# Altium schematic sheet DDM_FOC_CostDown_Modify_X1.4.schdoc
size D; PageSetup: Record=PageOptions|CenterHorizontal=True|CenterVertical=True|PrintScale=0.51|XCorrection=1.00|YCorrection=1.00|PrintKind=1|BorderSize=5000000|LeftOffset=0|BottomOffset=0|Orientation=2|PaperLength=1000|PaperWidth=1000|Scale=100|PaperSource=15|PrintQuality=600|MediaType=1|DitherType=10|PrintScaleMode=1|PaperKind=A3
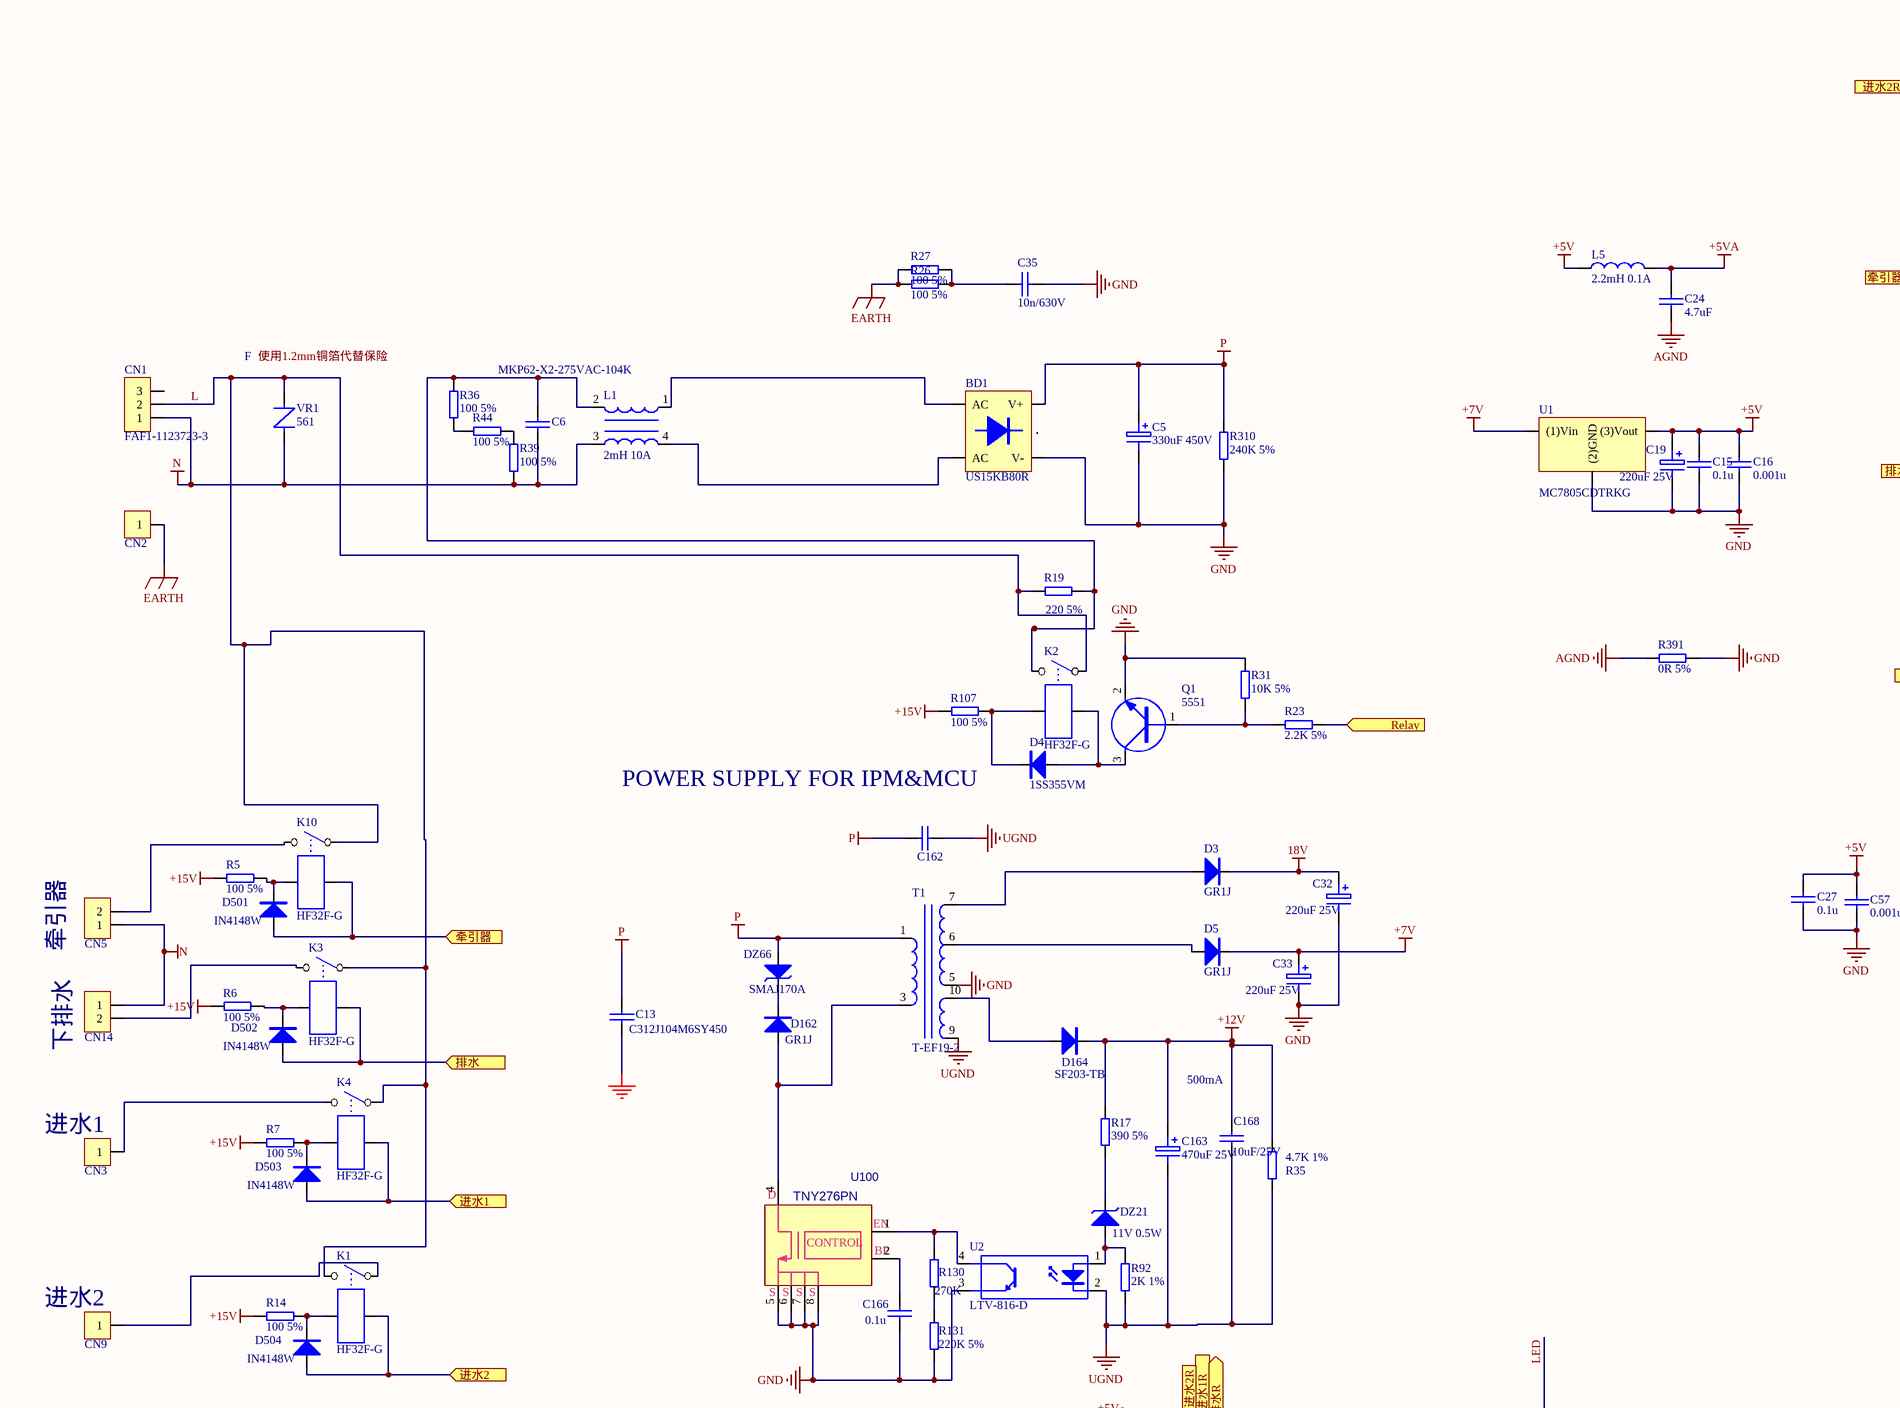
[diagram p0: DDM_FOC_CostDown_Modify_X1.4.schdoc, top left]
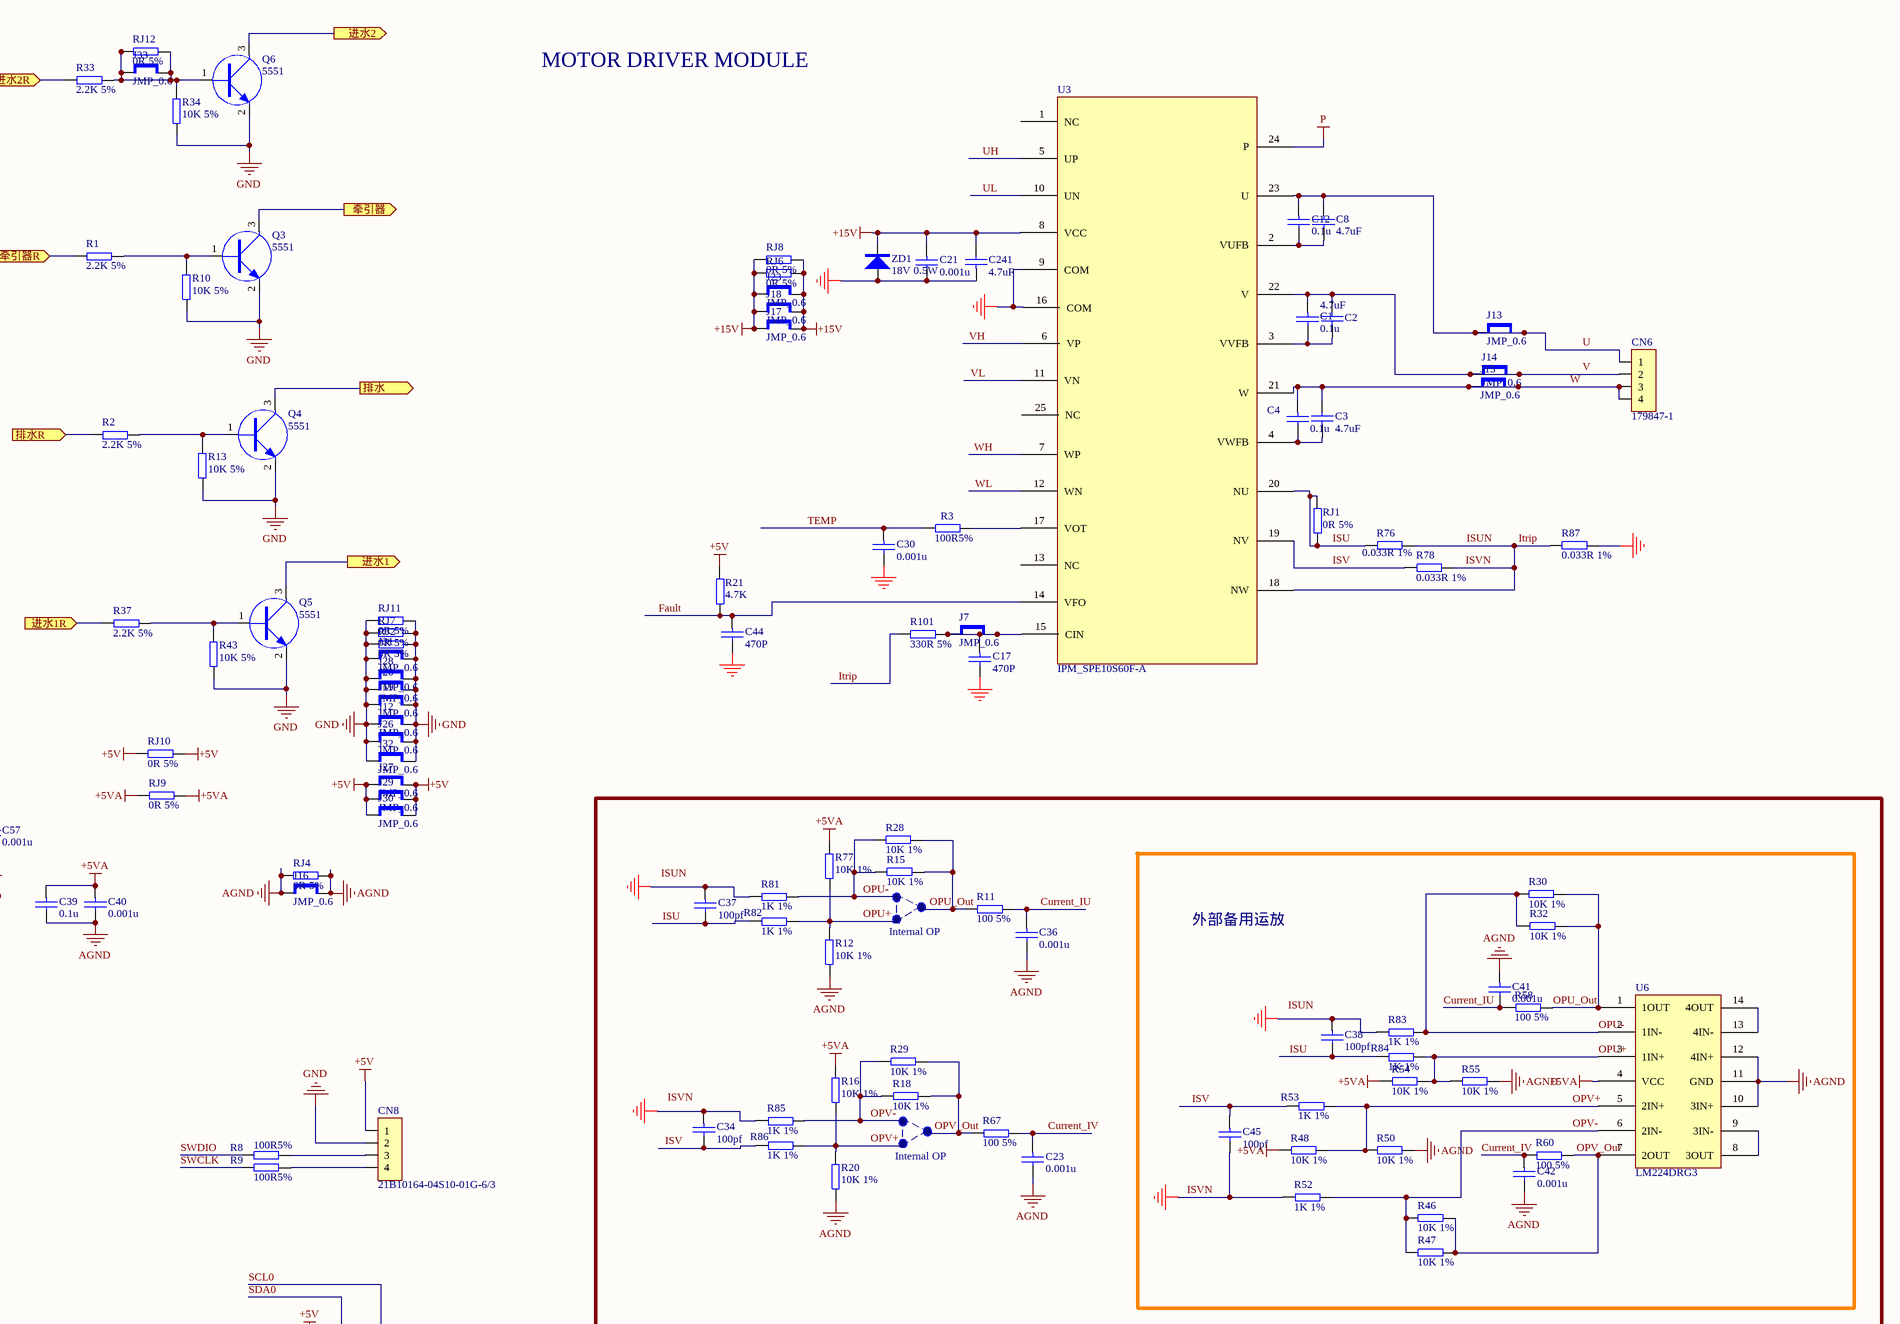
[diagram p1: DDM_FOC_CostDown_Modify_X1.4.schdoc, top right]
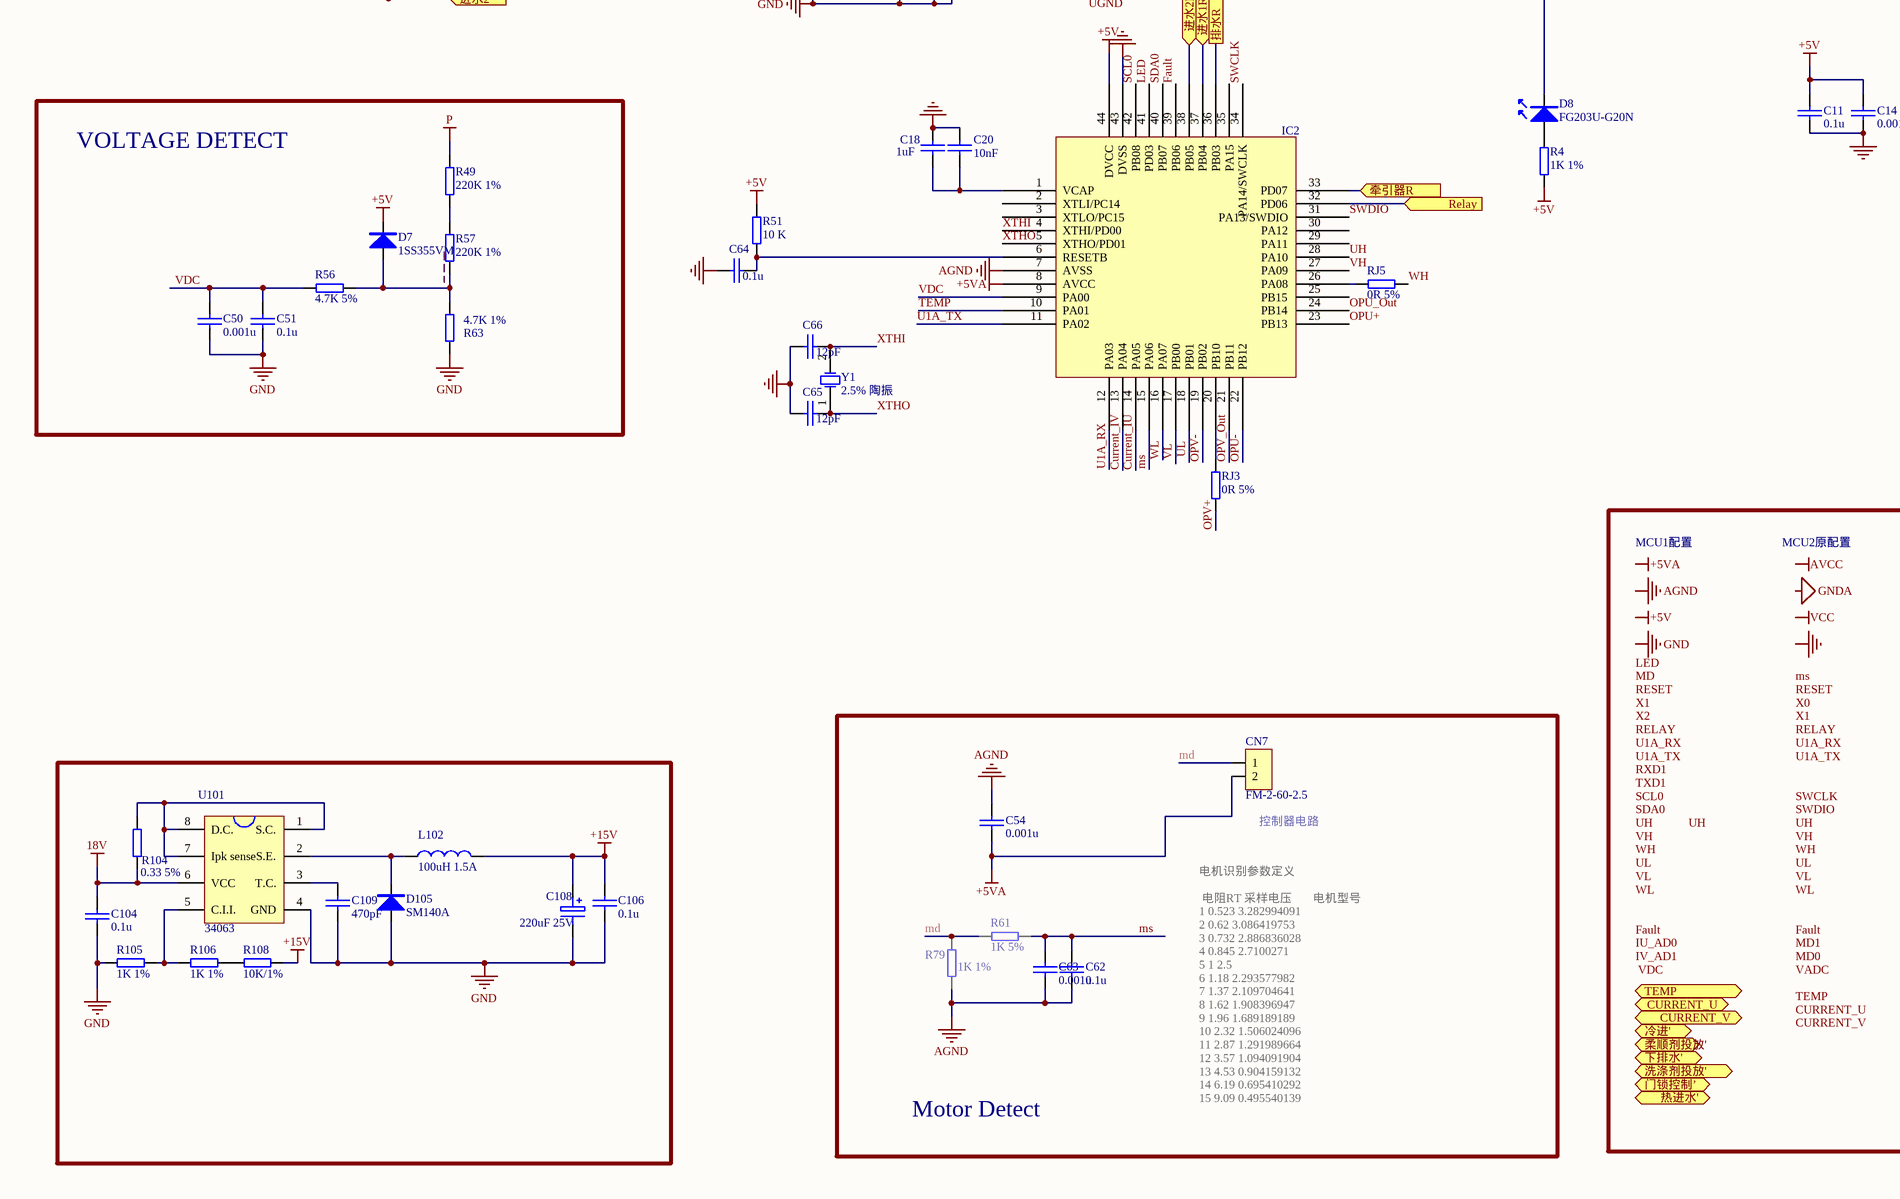
[diagram p2: DDM_FOC_CostDown_Modify_X1.4.schdoc, bottom left]
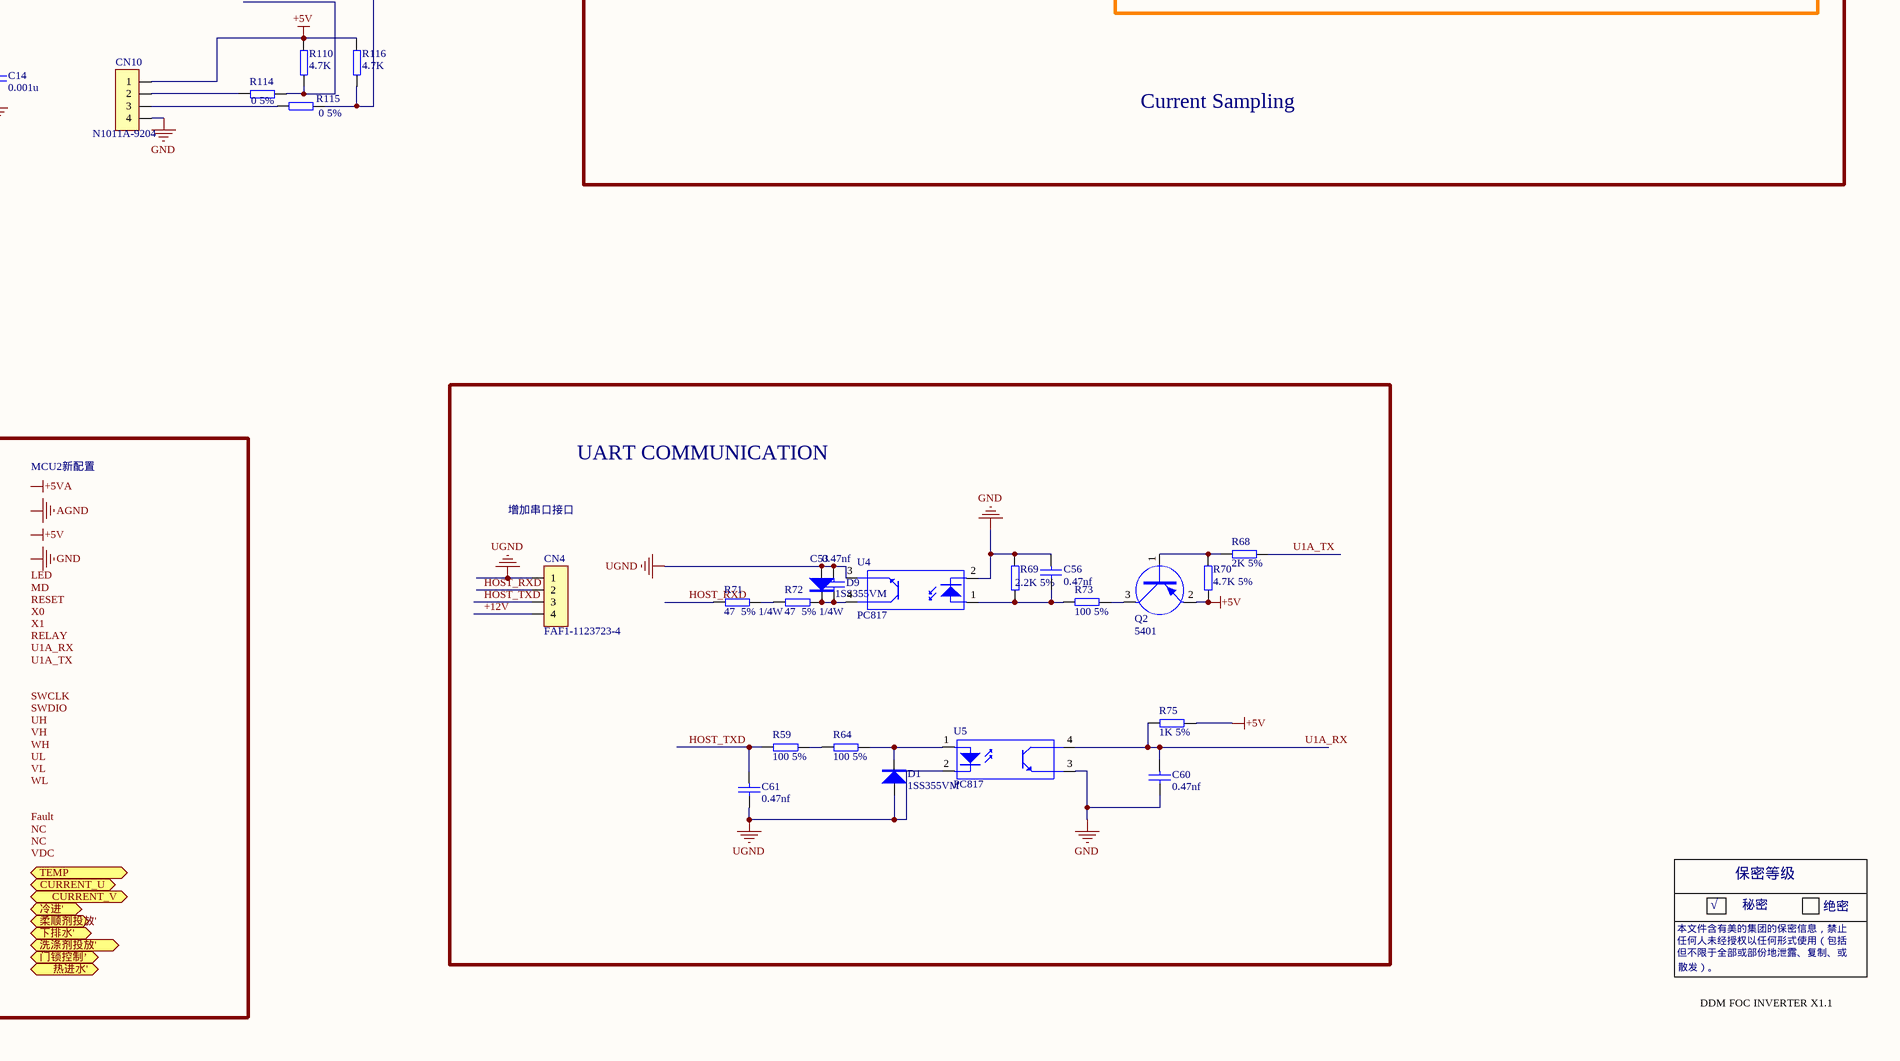
[diagram p3: DDM_FOC_CostDown_Modify_X1.4.schdoc, bottom right]

## Parts
BD1  US15KB80R  [BD/D6K]
C1  0.1u  [C/0603]
C2  4.7uF  [C/1206]
C3  4.7uF  [C/1206]
C4  0.1u  [C/0603]
C5  330uF 450V  [E/10/35]
C6  MKP62-X2-275VAC-104K  [C/15/18*8.5]
C8  4.7uF  [C/1206]
C11  0.1u  [C/0603]
C12  0.1u  [C/0603]
C13  C312J104M6SY450  [C/15 /17.5*7.6]
C14  0.001u  [C/0603]
C15  0.1u  [C/0603]
C16  0.001u  [C/0603]
C17  470P  [C/0603]
C18  1uF  [C0603]
C19  220uF 25V  [E/5/8-@]
C20  10nF  [C0603]
C21  0.001u  [C/0603]
C23  0.001u  [C/0603]
C24  4.7uF  [C/0805]
C27  0.1u  [C/0603]
C30  0.001u  [C/0603]
C32  220uF 25V  [E/5/8-@]
C33  220uF 25V  [E/5/8-@]
C34  100pf  [C/0603]
C35  10n/630V  [C/10/14.4*7]
C36  0.001u  [C/0603]
C37  100pf  [C/0603]
C38  100pf  [C/0603]
C39  0.1u  [C/0603]
C40  0.001u  [C/0603]
C41  0.001u  [C/0603]
C42  0.001u  [C/0603]
C44  470P  [C/0603]
C45  100pf  [C/0603]
C50  0.001u  [C/0603]
C51  0.1u  [C/0603]
C53  0.47nf  [C/0603]
C54  0.001u  [C/0603-SMT]
C56  0.47nf  [C/0603]
C57  0.001u  [C/0603]
C60  0.47nf  [C/0603]
C61  0.47nf  [C/0603-SMT]
C62  0.1u  [C/0603]
C63  0.001u  [C/0603-SMT]
C64  0.1u  [C/0603]
C65  12pF  [C/0603]
C66  12pF  [C/0603]
C104  0.1u  [C/0603]
C106  0.1u  [C/0603]
C108  220uF 25V  [E/5/8-@]
C109  470pF  [C/0603]
C162  CD12-E2GA471MYNS  [C/10/14.4*7]  (value not drawn)
C163  470uF 25V  [E/5/10-@]
C166  0.1u  [C/0603]
C168  10uF/25V  [C/0805]
C241  4.7uF  [C/0805]
CN1  FAF1-1123723-3  [CN/7.92/2]
CN2  CDW2.36-1P YE  [CN/CDW2.1-1P]  (value not drawn)
CN3  CDW2.36-1P YE  [CN/CDW2.1-1P]  (value not drawn)
CN4  FAF1-1123723-4  [CN/2.5/4-8 - 1]
CN5  PA1010  [CN/XH-2.1-2A]  (value not drawn)
CN6  179847-1  [CN/6.5/3/01]
CN7  FM-2-60-2.5  [CN/2.5/2-3]
CN8  21B10164-04S10-01G-6/3  [CN/2.54/4]
CN9  CDW2.36-1P YE  [CN/CDW2.1-1P]  (value not drawn)
CN10  N1011A-9204  [CN/2.54/4]
CN14  PA1010  [CN/XH-2.1-2A]  (value not drawn)
D1  1SS355VM  [D/SOD-123]
D3  GR1J  [D/DO214AC]
D4  1SS355VM  [SOD/323]
D5  GR1J  [D/DO214AC]
D7  1SS355VM  [SOD/323]
D8  FG203U-G20N  [LED/2.54/Φ3-@]
D9  1SS355VM  [D/SOD-123]
D105  SM140A  [D/DO214AC]
D162  GR1J  [D/DO214AC]
D164  SF203-TB  [D/DO214AC]
D501  IN4148W  [D/SOD-123]
D502  IN4148W  [D/SOD-123]
D503  IN4148W  [D/SOD-123]
D504  IN4148W  [D/SOD-123]
DZ21  11V 0.5W  [D/SOD80]
DZ66  SMAJ170A  [D/DO214AC]
IC2  HC32F030  (value not drawn)
J7  JMP_0.6  [J/10-@]
J12  JMP_0.6  [J/7-@]
J13  JMP_0.6  [J/14-@]
J14  JMP_0.6  [J/14-@]
J15  JMP_0.6  [J/16-@]
J16  JMP_0.6  [J/9-@]
J17  JMP_0.6  [J/8-@]
J18  JMP_0.6  [J/6-@]
J19  JMP_0.6  [J/15-@]
J20  JMP_0.6  [J/17-@]
J23  JMP_0.6  [J/18-@]
J26  JMP_0.6  [J/9-@]
J27  JMP_0.6  [J/9-@]
J28  JMP_0.6  [J/12-@]
J29  JMP_0.6  [J/7-@]
J30  JMP_0.6  [J/8-@]
J31  JMP_0.6  [J/7-@]
J32  JMP_0.6  [J/12-@]
J33  JMP_0.6  [J/6-@]
K1  HF32F-G  [RY/HF32]
K2  HF32F-G  [RY/HF32]
K3  HF32F-G  [RY/HF32]
K4  HF32F-G  [RY/HF32]
K10  HF32F-G  [RY/HF32]
L1  2mH 10A  [L/18*21]
L5  2.2mH 0.1A  [L/15/0410@]
L102  100uH 1.5A  [L/5/11]
Q1  5551  [Q/SOT23]
Q2  5401  [Q/SOT23]
Q3  5551  [Q/SOT23]
Q4  5551  [Q/SOT23]
Q5  5551  [Q/SOT23]
Q6  5551  [Q/SOT23]
R1  2.2K 5%  [R/0805]
R2  2.2K 5%  [R/0805]
R3  100R5%  [R/0805]
R4  1K 1%  [R/0805]
R5  100 5%  [R/1206]
R6  100 5%  [R/1206]
R7  100 5%  [R/1206]
R8  100R5%  [R/0805]
R9  100R5%  [R/0805]
R10  10K 5%  [R/0805]
R11  100 5%  [R/0805]
R12  10K 1%  [R/0805]
R13  10K 5%  [R/0805]
R14  100 5%  [R/1206]
R15  10K 1%  [R/0805]
R16  10K 1%  [R/0805]
R17  390 5%  [R/1206]
R18  10K 1%  [R/0805]
R19  220 5%  [R/7.5/PTC]
R20  10K 1%  [R/0805]
R21  4.7K  [R/0805]
R23  2.2K 5%  [R/0805]
R26  100 5%  [R/1206]
R27  100 5%  [R/1206]
R28  10K 1%  [R/0805]
R29  10K 1%  [R/0805]
R30  10K 1%  [R/0805]
R31  10K 5%  [R/0805]
R32  10K 1%  [R/0805]
R33  2.2K 5%  [R/0805]
R34  10K 5%  [R/0805]
R35  4.7K 1%  [R/0805]
R36  100 5%  [R/1206]
R37  2.2K 5%  [R/0805]
R39  100 5%  [R/1206]
R43  10K 5%  [R/0805]
R44  100 5%  [R/1206]
R46  10K 1%  [R/0805]
R47  10K 1%  [R/0805]
R48  10K 1%  [R/0805]
R49  220K 1%  [R/1206]
R50  10K 1%  [R/0805]
R51  10 K  [R/0805]
R52  1K 1%  [R/0805]
R53  1K 1%  [R/0805]
R54  10K 1%  [R/0805]
R55  10K 1%  [R/0805]
R56  4.7K 5%  [R/0805]
R57  220K 1%  [R/1206]
R58  100 5%  [R/0805]
R59  100 5%  [R/1206]
R60  100 5%  [R/0805]
R61  1K 5%  [R/0805]
R63  4.7K 1%  [R/0805]
R64  100 5%  [R/1206]
R67  100 5%  [R/0805]
R68  2K 5%  [R/0805]
R69  2.2K 5%  [R/0805]
R70  4.7K 5%  [R/0805]
R71  47  5% 1/4W  [R/1206]
R72  47  5% 1/4W  [R/1206]
R73  100 5%  [R/1206]
R75  1K 5%  [R/0805]
R76  0.033R 1%  [R/2512]
R77  10K 1%  [R/0805]
R78  0.033R 1%  [R/2512]
R79  1K 1%  [R/0805]
R81  1K 1%  [R/0805]
R82  1K 1%  [R/0805]
R83  1K 1%  [R/0805]
R84  1K 1%  [R/0805]
R85  1K 1%  [R/0805]
R86  1K 1%  [R/0805]
R87  0.033R 1%  [R/2512]
R92  2K 1%  [R/0805]
R101  330R 5%  [R/0805]
R104  0.33 5%  [R/1206]
R105  1K 1%  [R/0805]
R106  1K 1%  [R/0805]
R107  100 5%  [R/1206]
R108  10K/1%  [R/0805]
R110  4.7K  [R/0805]
R114  0 5%  [R/0805]
R115  0 5%  [R/0805]
R116  4.7K  [R/0805]
R130  270K  [R/0805]
R131  220K 5%  [R/0805]
R310  240K 5%  [R/2512]
R391  0R 5%  [J/1206]
RJ1  0R 5%  [J/1206]
RJ2  0R 5%  [J/1206]
RJ3  0R 5%  [J/1206]
RJ4  0R 5%  [J/1206]
RJ5  0R 5%  [J/1206]
RJ6  0R 5%  [J/1206-1]
RJ7  0R 5%  [J/1206-1]
RJ8  0R 5%  [J/1206]
RJ9  0R 5%  [J/1206]
RJ10  0R 5%  [J/1206]
RJ11  0R 5%  [J/1206-1]
RJ12  0R 5%  [J/1206]
T1  T-EF19-2  [T_EE19211 - 1]
U1  MC7805CDTRKG  [IC/DPAK-3]
U2  LTV-816-D  [LTV-816S - @]
U3  IPM_SPE10S60F-A  [IC_IPM_P]
U4  PC817  [LTV-816S - @]
U5  PC817  [LTV-816S - @]
U6  LM224DRG3
U100  TNY276PN  [IC/DIP/7/3/8.5]
U101  34063  [IC/SOP/1.27/8/4-r]
VR1  561  [VR/5/15/7.5-@]
Y1  2.5% 陶振  [R38]
ZD1  18V 0.5W  [D/SOD80]

## Blocks framed on the sheet
Current Sampling: C23 C34 C36 C37 R11 R12 R15 R16 R18 R20 R28 R29 R67 R77 R81 R82 R85 R86
外部备用运放: C38 C41 C42 C45 R30 R32 R46-R48 R50 R52-R55 R58 R60 R83 R84 U6
VOLTAGE DETECT: C50 C51 D7 R49 R56 R57 R63
UART COMMUNICATION: C53 C56 C60 C61 CN4 D1 D9 Q2 R59 R64 R68-R73 R75 U4 U5
Motor Detect: C54 C62 C63 CN7 R61 R79

## Ports
CURRENT_U (out), CURRENT_V (out), Relay (in), TEMP (out), 下排水' (in), 冷进' (in), 排水 (in), 排水 (out), 排水R (in), 排水R (out), 柔顺剂投放' (out), 洗涤剂投放' (in), 热进水' (in), 牵引器 (in), 牵引器 (out), 牵引器R (in), 进水1 (in), 进水1 (out), 进水1R (in), 进水2 (in), 进水2 (out), 进水2R (in), 门锁控制’ (in)

## Nets
18V: C32.1 C104.1 D3.2(K) R104.1 U101.6(VCC)
+5V: C11.1 C14.1 C15.1 C16.1 C19.1 C27.1 C57.1 CN8.1 CN10.1 D7.2 IC2.44(DVCC) J27.1 J27.2 J29.1 J29.2 J30.1 J30.2 L5.1 Q2.2(E) R4.2 R21.1 R51.1 R70.2 R75.2 R110.1 R116.1 RJ10.1 RJ10.2 U1.3((3)Vout)
+5VA: C24.2 C39.1 C40.1 C54.2 CN7.2 IC2.8(AVCC) L5.2 R16.2 R48.2 R54.2 R77.2 RJ9.1 RJ9.2 U6.4(VCC)
+7V: C33.1 D5.2(K) U1.1((1)Vin)
+12V: C163.1 C168.1 CN4.4 D164.2(K) R17.2 R35.2
+15V: C21.1 C106.1 C108.1 C241.2 J17.1 J17.2 J18.1 J18.2 J23.1 J23.2 L102.2 R5.1 R6.1 R7.1 R14.1 R107.1 R108.2 RJ6.1 RJ6.2 RJ8.1 RJ8.2 U3.8(VCC) ZD1.2(K)
AGND: C23.2 C24.1 C36.2 C39.2 C40.2 C41.1 C42.2 C54.1 C62.2 C63.2 IC2.7(AVSS) J16.1 J16.2 R12.1 R20.1 R50.1 R55.1 R79.1 R391.2 RJ4.1 RJ4.2 U6.10(3IN+) U6.11(GND) U6.12(4IN+)
EARTH: CN2.1 R26.1 R27.1
ISUN: BD1.1(V-) C5.2 C11.2 C13.1 C14.2 C15.2 C16.2 C17.2 C18.1 C19.2 C20.2 C21.2 C27.2 C30.2 C32.2 C33.2 C34.1 C35.1 C37.1 C38.1 C44.2 C45.2 C50.2 C51.2 C56.1 C57.2 C60.2 C64.2 C65.2 C66.2 C104.2 C106.2 C108.2 C109.2 C166.2 C241.1 CN8.2 CN10.4 D105.1(A) IC2.43(DVSS) J12.1 J12.2 J19.1 J19.2 J20.1 J20.2 J26.1 J26.2 J28.1 J28.2 J31.1 J31.2 J32.1 J32.2 Q1.2(E) Q3.2(E) Q4.2(E) Q5.2(E) Q6.2(E) R10.1 R13.1 R31.1 R34.1 R43.1 R52.1 R63.1 R69.1 R76.1 R78.1 R81.1 R83.1 R85.1 R87.1 R87.2 R101.2 R105.2 R131.1 R310.2 R391.1 RJ2.1 RJ2.2 RJ7.1 RJ7.2 RJ11.1 RJ11.2 T1.5 U1.2((2)GND) U2.3(E) U3.9(COM) U3.16(COM) U3.18(NW) U4.2(K) U5.3(E) U100.5(S) U100.6(S) U100.7(S) U100.8(S) U101.4(GND) ZD1.1(A)  [also labelled GND, ISVN, Itrip]
N: C6.1 CN1.1 CN5.1 CN14.1 L1.3 R39.1 VR1.2
P: BD1.4(V+) C5.1 C13.2 C162.1 DZ66.1(A) R49.2 R310.1 T1.1 U3.24(P)
UGND: C53.1 C61.2 C162.2 C163.2 C168.2 CN4.1 D1.1 D9.1 R35.1 R92.1 T1.9 U2.2(K) U4.3(E) U5.2(K)
Current_IU: C36.1 C41.2 IC2.14(PA05) R11.2 R58.1
Current_IV: C23.1 C42.1 IC2.13(PA04) R60.1 R67.2
Fault: C44.1 IC2.39(PB06) R21.2 U3.14(VFO)
HOST_RXD: CN4.2 R71.1
HOST_TXD: C61.1 CN4.3 R59.1
ISU: C37.2 C38.2 R76.2 R82.1 R84.1 RJ1.1 RJ1.2 U3.20(NU)
ISV: C34.2 C45.1 R53.1 R78.2 R86.1 U3.19(NV)
L: CN1.2 K1.4 K2.3 K3.3 K4.3 K10.3 R19.2 VR1.1
LED: D8.2(K) IC2.41(PD03)
md: CN7.1 R61.2 R79.2
ms: C62.1 C63.1 IC2.15(PA06) R61.1
OPU+: IC2.23(PB13) R12.2 R54.1 R55.2 R77.1 R82.2 R84.2 U6.3(1IN+)
OPU-: IC2.22(PB12) R15.2 R28.2 R30.2 R32.2 R81.2 R83.2 U6.2(1IN-)
OPU_Out: IC2.24(PB14) R11.1 R15.1 R28.1 R30.1 R32.1 R58.2 U6.1(1OUT)
OPV+: R16.1 R20.2 R48.1 R50.2 R53.2 R86.2 RJ3.1 U6.5(2IN+)
OPV-: IC2.19(PB02) R18.2 R29.2 R46.2 R47.2 R52.2 R85.2 U6.6(2IN-)
OPV_Out: IC2.21(PB11) R18.1 R29.1 R46.1 R47.1 R60.2 R67.1 U6.7(2OUT)
Relay: IC2.32(PD06) R23.1 ; port Relay
SCL0: IC2.42(PB08) R115.2 R116.2
SDA0: IC2.40(PB07) R110.2 R114.2
SWCLK: IC2.34(PA14/SWCLK) R9.2
SWDIO: IC2.31(PA13/SWDIO) R8.2
TEMP: C30.1 IC2.10(PA01) R3.2
U: C8.1 C12.1 CN6.1 J13.1 J13.2 U3.23(U)
U1A_RX: C60.1 IC2.12(PA03) R75.1 U5.4(C)
U1A_TX: IC2.11(PA02) R68.2
UH: IC2.28(PA10) U3.5(UP)
UL: IC2.18(PB01) U3.10(UN)
V: C1.1 C2.2 CN6.2 J14.1 J14.2 U3.22(V)
VDC: C50.1 C51.1 IC2.9(PA00) R56.1
VH: IC2.27(PA09) U3.6(VP)
VL: IC2.17(PB00) U3.11(VN)
W: C3.2 C4.1 CN6.3 CN6.4 J15.1 J15.2 U3.21(W)
WH: RJ5.1 U3.7(WP)
WL: IC2.16(PA07) U3.12(WN)
XTHI: C66.1 IC2.4(XTHI/PD00) Y1.2(OSC2)
XTHO: C65.1 IC2.5(XTHO/PD01) Y1.1(OSC1)
排水: D502.1 K3.1 Q4.3(C) ; port 排水
排水R: IC2.36(PB03) R2.1 ; port 排水R
牵引器: D501.1 K10.1 Q3.3(C) ; port 牵引器
牵引器R: IC2.33(PD07) R1.1 ; port 牵引器R
进水1: D503.1 K4.1 Q5.3(C) ; port 进水1
进水1R: IC2.37(PB04) R37.1 ; port 进水1R
进水2: D504.1 K1.1 Q6.3(C) ; port 进水2
进水2R: IC2.38(PB05) R33.1 ; port 进水2R
NetBD1_2: BD1.2(AC) L1.4
NetBD1_3: BD1.3(AC) L1.1
NetC1_2: C1.2 C2.1 U3.3(VVFB)
NetC3_1: C3.1 C4.2 U3.4(VWFB)
NetC6_2: C6.2 K2.4 L1.2 R19.1 R36.2
NetC8_2: C8.2 C12.2 U3.2(VUFB)
NetC17_1: C17.1 J7.1 J7.2 R101.1 U3.15(CIN)
NetC18_2: C18.2 C20.1 IC2.1(VCAP)
NetC35_2: C35.2 R26.2 R27.2
NetC53_2: C53.2 D9.2 R72.2 U4.4(C)
NetC56_2: C56.2 R69.2 R73.2 U4.1(A)
NetC64_1: C64.1 IC2.6(RESETB) R51.2
NetC109_1: C109.1 U101.3(T.C.)
NetC166_1: C166.1 U100.2
NetCN3_1: CN3.1 K4.4
NetCN5_2: CN5.2 K10.4
NetCN8_3: CN8.3 R8.1
NetCN8_4: CN8.4 R9.1
NetCN9_1: CN9.1 K1.3
NetCN10_2: CN10.2 R114.1
NetCN10_3: CN10.3 R115.1
NetCN14_2: CN14.2 K3.4
NetD1_2: D1.2 R64.2 U5.1(A)
NetD3_1: D3.1(A) T1.7
NetD4_1: D4.1 K2.1 Q1.3(C)
NetD4_2: D4.2 K2.2 R107.2
NetD5_1: D5.1(A) T1.6
NetD7_1: D7.1 R56.2 R57.1 R63.2
NetD8_1: D8.1(A) R4.1
NetD105_2: D105.2(K) L102.1 U101.2(S.E.)
NetD162_1: D162.1(A) T1.3 U100.4(D)
NetD162_2: D162.2(K) DZ66.2(K)
NetD164_1: D164.1(A) T1.10
NetD501_2: D501.2 K10.2 R5.2
NetD502_2: D502.2 K3.2 R6.2
NetD503_2: D503.2 K4.2 R7.2
NetD504_2: D504.2 K1.2 R14.2
NetDZ21_1: DZ21.1(A) R92.2 U2.1(A)
NetDZ21_2: DZ21.2(K) R17.1
NetIC2_20: IC2.20(PB10) RJ3.2
NetIC2_26: IC2.26(PA08) RJ5.2
NetJ33_1: J33.1 J33.2 Q6.1(B) R33.2 R34.2 RJ12.1 RJ12.2
NetQ1_1: Q1.1(B) R23.2 R31.2
NetQ2_1: Q2.1(B) R68.1 R70.1
NetQ2_3: Q2.3(C) R73.1
NetQ3_1: Q3.1(B) R1.2 R10.2
NetQ4_1: Q4.1(B) R2.2 R13.2
NetQ5_1: Q5.1(B) R37.2 R43.2
NetR3_1: R3.1 U3.17(VOT)
NetR36_1: R36.1 R44.2
NetR39_2: R39.2 R44.1
NetR49_1: R49.1 R57.2
NetR59_2: R59.2 R64.1
NetR71_2: R71.2 R72.1
NetR104_2: R104.2 U101.1(S.C.) U101.7(Ipk_sense) U101.8(D.C.)
NetR105_1: R105.1 R106.2 U101.5(C.I.I.)
NetR106_1: R106.1 R108.1
NetR130_1: R130.1 R131.2
NetR130_2: R130.2 U2.4(C) U100.1
NetU6_8: U6.8(3OUT) U6.9(3IN-)
NetU6_13: U6.13(4IN-) U6.14(4OUT)

Not connected (* = marked no-connect by the designer): CN1 3; IC2 2(XTLI/PC14) 3(XTLO/PC15) 25(PB15) 29(PA11) 30(PA12) 35(PA15); U3 1(NC) 13(NC) 25(NC)

## Notes on the sheet
- MOTOR DRIVER MODULE
- (near VR1) F
- POWER SUPPLY FOR IPM&MCU
- (near CN5) 牵引器
- (near CN14) 下排水
- (near R11) Internal OP
- 500mA
- (near CN3) 进水1
- (near R67) Internal OP
- (near CN9) 进水2
- MCU1配置
- MCU2原配置
- MCU2新配置
- 增加串口接口
- (near CN7) 控制器电路
- 保密等级
- 本文件含有美的集团的保密信息，禁止
- 任何人未经授权以任何形式使用（包括
- 但不限于全部或部份地泄露、复制、或
- √
- 秘密
- 绝密
- 电机识别参数定义
  电阻RT	采样电压	      电机型号
  1	0.523	3.282994091
  2	0.62	3.086419753
  3	0.732	2.886836028
  4	0.845	2.7100271
  5	1	2.5
  6	1.18	2.293577982
  7	1.37	2.109704641
  8	1.62	1.908396947
  9	1.96	1.689189189
  10	2.32	1.506024096
  11	2.87	1.291989664
  12	3.57	1.094091904
  13	4.53	0.904159132
  14	6.19	0.695410292
  15	9.09	0.495540139
- 散发）。
- DDM FOC INVERTER X1.1
- Labels drawn without touching a wire or pin: +5V, +5VA, AGND, AVCC, CURRENT_U, CURRENT_V, Fault, GND, GNDA, ISUN, ISVN, IU_AD0, IV_AD1, LED, MD, MD0, MD1, ms, NC, RELAY, RESET, RXD1, SCL0, SDA0, SWCLK, SWDIO, TEMP, TXD1, U1A_RX, U1A_TX, UH, UL, VADC, VCC, VDC, VH, VL, WH, WL, X0, X1, X2, 使用1.2mm铜箔代替保险
- Title
- Size:
- Date:
- File:
- A0
- Number:
- Time:
- Revision:
- Sheet
- of
- (in symbol TNY27XP) EN; CONTROL; BP

## Library data of the parts
BD1 = BD_15A/800V: 整流桥; coding: 302300577011
C1 C4 C11 C12 C14-C16 C21 C34 C37-C40 C44 C45 C50 C51 C54 C57 C62 C63 = C_SMD0805_104/50V_10%_X7R: 贴片电容; coding: 302300317093
C2 C3 C8 = C_SMD1206_475/25V_10%_X7R: 瓷片电容; coding: 302300317270
C5 = E_330UF/450V_85C_1: 电解电容; coding: 302300327311
C6 = C_104/AC275V_10%_X2: 薄膜电容; coding: 302300377035
C13 = C_104/630V_5%_FILM: 薄膜电容C312J104M6SY450; coding: 302300377083
C17 C23 C30 C36 C41 C42 = C_SMD0603_102/50V_10%_X7R: 瓷片电容; coding: 302300317008
C18 C20 = CAP-CC(SMD): Ceramic Capacitor,0603
C19 C32 C33 C108 = E_220UF/25V_105C_L: 电解电容; coding: 302300327184
C24 C241 = C_SMD0805_475/16V_10%_X7R: 瓷片电容; coding: 302300317266
C27 = C_SMD0603_104/50V_10%_X7R: 贴片电容; coding: 302300317042
C35 = C_103/63V_10%_FILM: 薄膜电容; coding: 302300377009
C53 C56 C60 C61 = C_SMD0603_471/50V_10%_X7R: 瓷片电容; coding: 302300317039
C64-C66 C166 = C_SMD0603_104/50V_10%_X7R: 瓷片电容; coding: 302300317042
C104 C106 = C_SMD0603_104/50V_10%_X7R: 贴片电容; coding: 11201209000087
C109 = C_SMD0603_471/50V_10%: 贴片电容; coding: 11201209000043
C162 = C_222/AC400V_20%_Y1: Y1电容; coding: 302300357026
C163 = E_470UF/25V_105C_L: 电解电容; coding: 302300327182
C168 = C_SMD0805_105/25V_10%_X7R: 瓷片电容; coding: 302300317277
CN1 = CN_3.96_3: 3针插座; coding: 302301417279
CN2 CN3 CN9 = CN_1_01: 1针黄色插座; coding: 302301400050
CN4 = CN_3.96_4: 4针插座; coding: 302301417310
CN5 CN14 = CN_8_2_05: 2针插座; coding: 302301417360
CN6 = CN_6.5_4_01: 4针插座
CN7 = CN_2.5_2: 线束; coding: 302402517357
CN8 = CN_2.54_4: 单排排针4PIN; coding: 302301017299
CN10 = CN_2.5_4_6: 4针插座; coding: 302301417514
D1 D4 D7 D9 = D_SMD_1SS355VM: 贴片塑封二极管; coding: 302300527059
D3 D5 D162 = D_SMD_GR1J: 二极管; coding: 302300527033
D8 = LED_FG203U-G20N: 插件发光二极管; coding: 302304017069
D105 = D_SMD_SM140A: 肖特基二极管; coding: 302300527058
D164 = D_STTH1R02QRL: 二极管; coding: 302300517028
D501-D504 = D_SMD_IN4148W: 塑封贴片二极管; coding: 302300527060
DZ21 = DZ_SMD_11V/0.5W: 稳压二极管; coding: 302300567030
DZ66 = D_SMD_SMAJ170A: TVS; coding: 302300527032
IC2 = HC32F030H8TA_LQFP44
J7 J12-J20 J23 J26-J33 = J_D0.6: 跳线; coding: 302301497002
K1-K4 K10 = RY_SPST_HF32F-G/012-HS: 继电器; coding: 302300817035
L1 = L_10A_2MH: 电感; coding: 302303627019
L5 = L_0.1A_1MH: 电感; coding: 302303627028
L102 = L_1.5A_100uH: 电感; coding: 302303627032
Q1 Q3-Q6 = Q_N_MMBT5551_SOT23: 三极管; coding: 302300547048
Q2 = Q_P_MMBT5401_SOT23: 三极管; coding: 302300547049
R1 R2 R23 R33 R37 R68 R69 = R_SMD_0805_2.2K: 电阻; coding: 302300117168
R3 R8 R9 R391 = R_SMD_1206_0R: 电阻; coding: 302300117396
R4 = R_SMD_0805_1K_1%: 贴片电阻; coding: 302300117220
R5-R7 R14 R26 R27 R36 R39 R44 R59 R64 R73 R107 = R_SMD_1206_100: 电阻; coding: 302300117426
R10 R13 R31 R34 R43 R310 = R_SMD_0805_10K: 电阻; coding: 302300117173
R11 R58 R60 R67 = R_SMD_0805_100: 贴片电阻; coding: 302300117202
R12 R15 R16 R18 R20 R28-R30 R32 R46-R48 R50 R54 R55 R77 = R_SMD_0805_24.9K_1%: 电阻; coding: 302300117526
R17 = R_SMD_1206_330: 电阻; coding: 302300117821
R19 = R_220_5%_2W: 电阻; coding: 302300157003
R21 R108 R110 R114-R116 = RES
R35 R63 = R_SMD_0805_2.43K_1%: 电阻; coding: 302300117461
R49 R57 = R_SMD_1206_220K_1%: 电阻; coding: 302300117755
R51 = R_SMD_0805_3.3K: 电阻; coding: 302300117216
R52 R53 R81-R86 = R_SMD_0805_3.09K_1%: 电阻; coding: 302300117464
R56 R70 = R_SMD_0805_4.7K: 电阻; coding: 302300117368
R61 R79 = R_SMD_0805_1K: 电阻; coding: 302300117153
R71 R72 = R_SMD_1206_47: 电阻; coding: *
R75 = R_SMD_0805_330: 电阻; coding: 302300117366
R76 R78 R87 = R_SMD_2512_150K: 电阻; coding: 302300117756
R92 = R_SMD_0805_2K_1%: 电阻; coding: 302300117211
R101 R105 R106 = R_SMD_0805_1K_1%: 电阻; coding: 302300117220
R104 = R_SMD_1206_330: 电阻; coding: 302300117813
R130 = R_SMD_0805_270K_1%: 贴片电阻; coding: 302300117508
R131 = R_SMD_0805_220K: 电阻; coding: 302300117240
RJ1-RJ12 = R_SMD_1206_0R: 贴片电阻; coding: 302300117396
U1 = IC_PWR_MC7805CDTRKG: 三端稳压器; coding: 302300767079
U2 = IC_PS2501: 光耦; coding: 302303837036
U4 U5 = IC_OPTO_PC817X2NXZW: 光耦; coding: 302303837014
U100 = TNY27XP: coding: 302300767035
U101 = IC_PWR_AZ34063U: 电源IC; coding: 302300767078
VR1 = VR_10D561: 压敏电阻; coding: 302304117047
Y1 = XTAL: Crystal Oscillator; Published: 8-Jun-2000; LatestRevisionDate: 17-Jul-2002; LatestRevisionNote: Re-released for DXP Platform.; PackageReference: R38; Publisher: Altium Limited; PackageDescription: Crystal, Thru-Hole; 2 Leads; Body 3.1 x 8.2 mm (Dia.xH)
ZD1 = DZ_SMD_18V/0.5W: 稳压二极管; coding: 302300567023